# Altium schematic sheet Master_HV_PCB.SchDoc
size A4; SheetNumber: 1; SheetTotal: 7
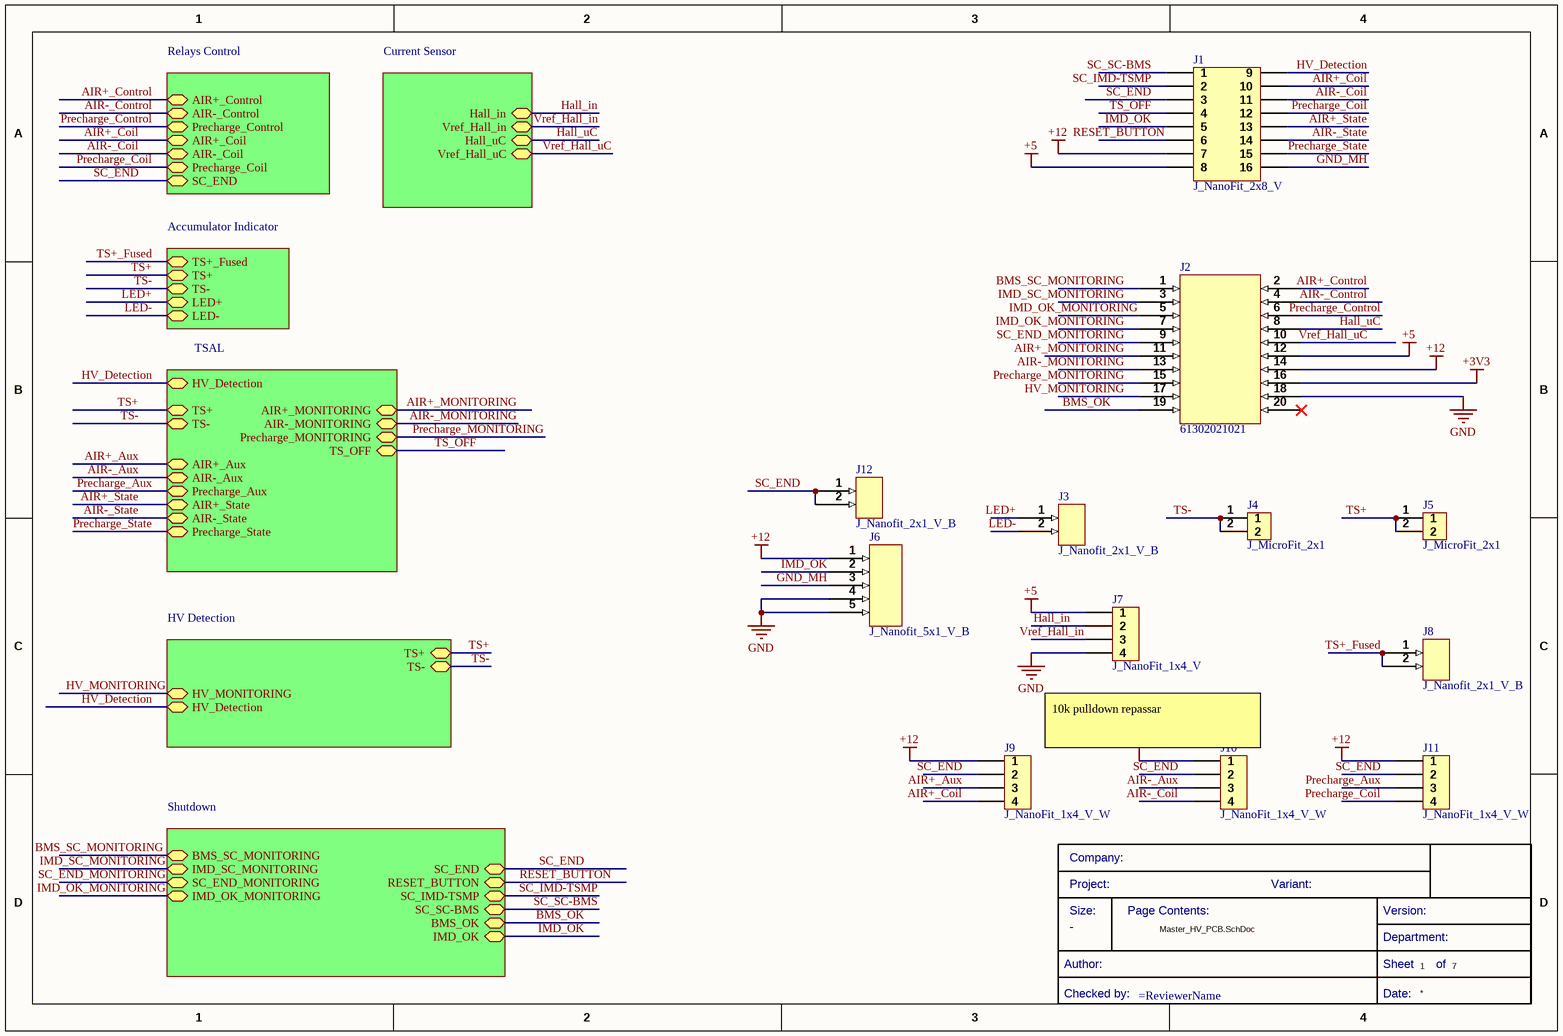
[diagram p0: Master_HV_PCB.SchDoc]

## Parts
?  (no value)  (graphical)
J1  J_NanoFit_2x8_V  [J_NanoFit_2x8_V]
J2  61302021021  [61302021021]
J3  J_Nanofit_2x1_V_B  [FP-105309-1102-MFG]
J4  J_MicroFit_2x1  [J_MicroFit_2x1]
J5  J_MicroFit_2x1  [J_MicroFit_2x1]
J6  J_Nanofit_5x1_V_B  [105309-1205-Footprint-1]
J7  J_NanoFit_1x4_V  [J_NanoFit_1x4_V]
J8  J_Nanofit_2x1_V_B  [FP-105309-1102-MFG]
J9  J_NanoFit_1x4_V_W  [J_NanoFit_1x4_V]
J10  J_NanoFit_1x4_V_W  [J_NanoFit_1x4_V]
J11  J_NanoFit_1x4_V_W  [J_NanoFit_1x4_V]
J12  J_Nanofit_2x1_V_B  [FP-105309-1102-MFG]

## Sub-sheets
Accumulator Indicator = [6]Accumulator_Indicator.SchDoc: TS+ (bidir), TS- (bidir), LED+ (bidir), LED- (bidir), TS+_Fused (bidir)
Current Sensor = [5]Current_Sensor.SchDoc: Hall_in (bidir), Vref_Hall_in (bidir), Hall_uC (bidir), Vref_Hall_uC (bidir)
HV Detection = [3]HV_Detection.SchDoc: TS+ (bidir), TS- (bidir), HV_MONITORING (bidir), HV_Detection (bidir)
Relays Control = [4]Relays_Control.SchDoc: AIR+_Control (bidir), AIR-_Control (bidir), Precharge_Control (bidir), AIR+_Coil (bidir), AIR-_Coil (bidir), Precharge_Coil (bidir), SC_END (bidir)
Shutdown = [1]Shutdown.SchDoc: BMS_SC_MONITORING (bidir), IMD_SC_MONITORING (bidir), SC_END_MONITORING (bidir), IMD_OK_MONITORING (bidir), BMS_OK (bidir), IMD_OK (bidir), SC_SC-BMS (bidir), SC_IMD-TSMP (bidir), RESET_BUTTON (bidir), SC_END (bidir)
TSAL = [2]TSAL.SchDoc: TS+ (bidir), TS- (bidir), AIR+_Aux (bidir), AIR-_Aux (bidir), Precharge_Aux (bidir), AIR+_State (bidir), AIR-_State (bidir), Precharge_State (bidir), AIR-_MONITORING (bidir), Precharge_MONITORING (bidir), AIR+_MONITORING (bidir), HV_Detection (bidir), TS_OFF (bidir)

## Nets
+3V3: J2.16
+5: J1.8 J2.12 J7.1
+12: J1.7 J2.14 J6.1 J9.1 J10.1 J11.1
GND: J2.18 J6.4 J6.5 J7.4
AIR+_Aux: J9.3 ; sheet TSAL/AIR+_Aux
AIR+_Coil: J1.10 J9.4 ; sheet Relays Control/AIR+_Coil
AIR+_Control: J2.2 ; sheet Relays Control/AIR+_Control
AIR+_MONITORING: J2.11 ; sheet TSAL/AIR+_MONITORING
AIR+_State: J1.13 ; sheet TSAL/AIR+_State
AIR-_Aux: J10.3 ; sheet TSAL/AIR-_Aux
AIR-_Coil: J1.11 J10.4 ; sheet Relays Control/AIR-_Coil
AIR-_Control: J2.4 ; sheet Relays Control/AIR-_Control
AIR-_MONITORING: J2.13 ; sheet TSAL/AIR-_MONITORING
AIR-_State: J1.14 ; sheet TSAL/AIR-_State
BMS_OK: J2.19 ; sheet Shutdown/BMS_OK
BMS_SC_MONITORING: J2.1 ; sheet Shutdown/BMS_SC_MONITORING
GND_MH: J1.16 J6.3
Hall_in: J7.2 ; sheet Current Sensor/Hall_in
Hall_uC: J2.8 ; sheet Current Sensor/Hall_uC
HV_Detection: J1.9 ; sheet TSAL/HV_Detection, sheet HV Detection/HV_Detection
HV_MONITORING: J2.17 ; sheet HV Detection/HV_MONITORING
IMD_OK: J1.5 J6.2 ; sheet Shutdown/IMD_OK
IMD_OK_MONITORING: J2.5 J2.7 ; sheet Shutdown/IMD_OK_MONITORING
IMD_SC_MONITORING: J2.3 ; sheet Shutdown/IMD_SC_MONITORING
LED+: J3.1 ; sheet Accumulator Indicator/LED+
LED-: J3.2 ; sheet Accumulator Indicator/LED-
Precharge_Aux: J11.3 ; sheet TSAL/Precharge_Aux
Precharge_Coil: J1.12 J11.4 ; sheet Relays Control/Precharge_Coil
Precharge_Control: J2.6 ; sheet Relays Control/Precharge_Control
Precharge_MONITORING: J2.15 ; sheet TSAL/Precharge_MONITORING
Precharge_State: J1.15 ; sheet TSAL/Precharge_State
RESET_BUTTON: J1.6 ; sheet Shutdown/RESET_BUTTON
SC_END: J1.3 J9.2 J10.2 J11.2 J12.1 J12.2 ; sheet Relays Control/SC_END, sheet Shutdown/SC_END
SC_END_MONITORING: J2.9 ; sheet Shutdown/SC_END_MONITORING
SC_IMD-TSMP: J1.2 ; sheet Shutdown/SC_IMD-TSMP
SC_SC-BMS: J1.1 ; sheet Shutdown/SC_SC-BMS
TS+: J5.1 J5.2 ; sheet Accumulator Indicator/TS+, sheet TSAL/TS+, sheet HV Detection/TS+
TS+_Fused: J8.1 J8.2 ; sheet Accumulator Indicator/TS+_Fused
TS-: J4.1 J4.2 ; sheet Accumulator Indicator/TS-, sheet TSAL/TS-, sheet HV Detection/TS-
TS_OFF: J1.4 ; sheet TSAL/TS_OFF
Vref_Hall_in: J7.3 ; sheet Current Sensor/Vref_Hall_in
Vref_Hall_uC: J2.10 ; sheet Current Sensor/Vref_Hall_uC

Not connected (* = marked no-connect by the designer): J2 20*

## Notes on the sheet
- (near J10) 10k pulldown repassar
- Size:
- Company:
- Project:
- Page Contents:
- Variant:
- Version:
- Checked by:
- Author:
- Sheet
- Date:
- Department:
- of

## Library data of the parts
? = CMP-00043-6: Standard Title Block
J1 = CMP-00020-2: Nano-Fit Vertical Header Through Hole 2.50mm Pitch Dual Row 16 Circuits with Kinked Pins Tin (Sn) Plating Black; Manufacturer 1: Molex; Manufacturer Part Number 1: 105310-1116; Connector Type: Header,Male Pin; Number of Positions: 16; .Creator: AC; Fastening Type: Latch; Contact Shape: Square; Mount: Through Hole; Stock 1: 84; ComponentLink2Description: Molex; Source: Electromechanical.SchLib; RoHS: No; Min Operating Temperature: -40°C; Number of Rows: 2; Termination: Kinked Pin; ComponentLink1Description: https://www.molex.com/pdm_docs/sd/1053101210_sd.pdf?src-supplier=Digi-Key; ComponentLink2URL: https://www.molex.com/molex/products/part-detail/pcb_headers/1053101116; Contact Plating: Tin; Insulation Color: Black; Insulation Material: Polymer; Contact Material: Brass; Max Operating Temperature: 105°C; Pricing 1: 1=3,21000, 10=2,82400, 84=2,24619, 1008=1,86110, 4956=1,66858 (USD); Packaging: Tray; ComponentLink1URL: https://www.molex.com/pdm_docs/sd/1053101210_sd.pdf?src-supplier=Digi-Key; Category: Headers and Wire Housings; Design Item ID: J_NanoFit_2x8_V
J2 = CMP-002-00010-1: Board Connector, 20 Contact(s), 2 Row(s), Male, Right Angle, 0.1 inch Pitch, Solder Terminal, Locking, Black Insulator, Plug; Mounting Technology: Board; Connector Type: BOARD CONNECTOR; Max Operating Temperature: 125°C; RoHS Compliant: Yes; Min Operating Temperature: -40°C
J3 J8 J12 = CMP-002-00012-1: Conn HDR 2 POS 2.5mm Solder ST Thru-Hole 2 Terminal 1 Port Nano-Fit Tray
J4 J5 = CMP-00012-1: Header 1 Row Vertical Polarizing Peg 2 Pin SMT/Glow Wire Compatible Tin Plate; Manufacturer 1: Molex; Manufacturer Part Number 1: 43650-0215; ComponentLink6Description: https://datasheet.ciiva.com/7920/1889390-7920892.pdf?src-supplier=Element14; ComponentLink2Description: https://datasheet.ciiva.com/5157/0436500215-pcb-headers-148687-5157608.pdf?src-supplier=Mouser; ComponentLink3Description: https://datasheet.ciiva.com/16085/0436500215-pcb-headers-16085668.pdf?src-supplier=Onlinecomponents.com; ComponentLink3URL: https://datasheet.ciiva.com/16085/0436500215-pcb-headers-16085668.pdf?src-supplier=Onlinecomponents.com; ComponentLink1URL: https://datasheet.ciiva.com/19462/884109-19462034.pdf?src-supplier=Jameco; ComponentLink4Description: https://datasheet.ciiva.com/11748/0900766b80307ce2-11748388.pdf?src-supplier=RSComponents; RoHS: Yes; Design Item ID: J_MicroFit_2x1; ComponentLink6URL: https://datasheet.ciiva.com/7920/1889390-7920892.pdf?src-supplier=Element14; Stock 1: 11086; ComponentLink2URL: https://datasheet.ciiva.com/5157/0436500215-pcb-headers-148687-5157608.pdf?src-supplier=Mouser; ComponentLink1Description: https://datasheet.ciiva.com/19462/884109-19462034.pdf?src-supplier=Jameco; Category: Headers and Wire Housings; ComponentLink5URL: https://datasheet.ciiva.com/9432/0436500215-pcb-headers-9432850.pdf?src-supplier=Avnet; ComponentLink5Description: https://datasheet.ciiva.com/9432/0436500215-pcb-headers-9432850.pdf?src-supplier=Avnet; ComponentLink4URL: https://datasheet.ciiva.com/11748/0900766b80307ce2-11748388.pdf?src-supplier=RSComponents; Pricing 1: 1=0,87800, 10=0,74400, 80=0,63070, 3264=0,47000, 6528=0,45100, 13056=0,41760 (USD); Source: Electromechanical.SchLib
J6 = CMP-002-00013-1: Nano-Fit Vertical Header Through Hole 2.50mm Pitch Single Row 5 Circuits with Kinked Pins 0.38
J7 = CMP-00018-1: Nano-Fit Vertical Header Through Hole 2.50mm Pitch Single Row 4 Circuits with Kinked Pins 0.38; Manufacturer 1: Molex; Manufacturer Part Number 1: 105309-1204; .Creator: DO; Pricing 1: 1=1,37050, 10=1,11700, 100=0,95270, 500=0,86980, 1000=0,74060, 2500=0,71930, 5000=0,68450, 10000=0,66860 (USD); ComponentLink2URL: http://www.farnell.com/datasheets/2221349.pdf?src-supplier=Newark; ComponentLink2Description: http://www.farnell.com/datasheets/2221349.pdf?src-supplier=Newark; ComponentLink4URL: http://www.farnell.com/datasheets/2059602.pdf?src-supplier=Element14; ComponentLink3Description: http://www.literature.molex.com/SQLImages/kelmscott/Molex/PDF_Images/987651-1223.PDF?src-supplier=Digi-Key; ComponentLink1URL: http://farnell.com//datasheets/2221349.pdf?src-supplier=Farnell; Source: Electromechanical.SchLib; ComponentLink3URL: http://www.literature.molex.com/SQLImages/kelmscott/Molex/PDF_Images/987651-1223.PDF?src-supplier=Digi-Key; Category: Headers and Wire Housings; Design Item ID: J_NanoFit_1x4_V; ComponentLink4Description: http://www.farnell.com/datasheets/2059602.pdf?src-supplier=Element14; ComponentLink1Description: http://farnell.com//datasheets/2221349.pdf?src-supplier=Farnell; Stock 1: 709; RoHS: No
J9-J11 = CMP-00027-1: Conn HDR 4 POS 2.5mm Solder ST Thru-Hole 4 Terminal 1 Port Nano-Fit Tray; Manufacturer Part Number 1: 105309-2104; Manufacturer 1: Molex; .Creator: DR; Stock 1: 1183; RoHS: No; Category: Headers and Wire Housings; Source: Electromechanical.SchLib; Design Item ID: J_NanoFit_1x4_V_W; Pricing 1: 1=1,30000, 10=1,15000, 25=1,11000, 50=1,07000, 100=1,02000, 250=0,94400 (USD)